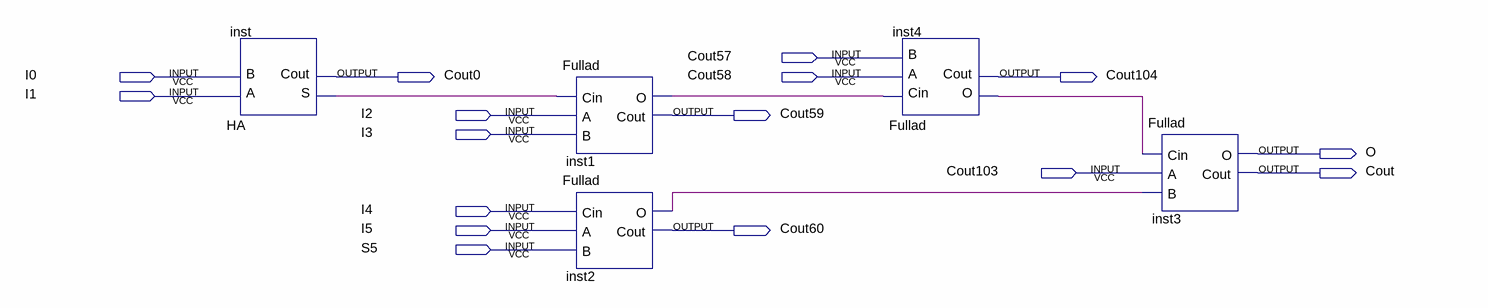
[diagram p0: schematic sheet]
// Quartus schematic B10.bdf as structural Verilog: 5 symbols, 16 pins
module B10 (
  input  Cout57,
  input  I0,
  input  Cout58,
  input  I1,
  input  I2,
  input  I3,
  input  Cout103,
  input  I4,
  input  I5,
  input  S5,
  output Cout0,
  output Cout104,
  output Cout59,
  output O,
  output Cout,
  output Cout60
);

  wire inst1_o, inst2_o, inst4_o, inst_s;

  HA inst (.A(I1), .B(I0), .S(inst_s), .Cout(Cout0));
  Fullad inst1 (.Cin(inst_s), .A(I2), .B(I3), .O(inst1_o), .Cout(Cout59));
  Fullad inst2 (.Cin(I4), .A(I5), .B(S5), .O(inst2_o), .Cout(Cout60));
  Fullad inst4 (.Cin(inst1_o), .A(Cout58), .B(Cout57), .O(inst4_o), .Cout(Cout104));
  Fullad inst3 (.Cin(inst4_o), .A(Cout103), .B(inst2_o), .O(O), .Cout(Cout));
endmodule
